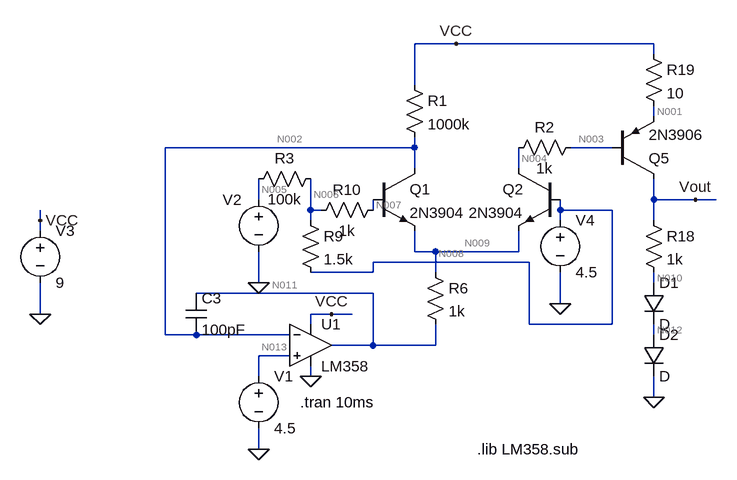
[diagram p0: schematic ExponentialSource_BJT.asc]
ExponentialSource_BJT.asc, the LTspice schematic file:
Version 4
SHEET 1 1524 724
WIRE 32 48 -32 48
WIRE 336 48 32 48
WIRE 336 64 336 48
WIRE -32 112 -32 48
WIRE 336 160 336 144
WIRE -32 208 -32 192
WIRE -32 208 -416 208
WIRE 272 208 208 208
WIRE -32 240 -32 208
WIRE 128 240 128 208
WIRE -272 288 -272 256
WIRE 336 288 336 256
WIRE 400 288 336 288
WIRE 432 288 400 288
WIRE -192 304 -192 256
WIRE -176 304 -192 304
WIRE -96 304 -96 288
WIRE 192 304 192 288
WIRE 272 304 192 304
WIRE -608 320 -608 304
WIRE -192 320 -192 304
WIRE 192 320 192 304
WIRE 336 320 336 288
WIRE -608 336 -608 320
WIRE -32 368 -32 336
WIRE 0 368 -32 368
WIRE 128 368 128 336
WIRE 128 368 0 368
WIRE 144 384 -96 384
WIRE -96 400 -96 384
WIRE -96 400 -192 400
WIRE 0 400 0 368
WIRE -272 416 -272 368
WIRE 336 416 336 400
WIRE -96 432 -368 432
WIRE 192 448 192 400
WIRE -608 464 -608 416
WIRE -160 464 -192 464
WIRE -128 464 -160 464
WIRE -192 480 -192 464
WIRE 144 480 144 384
WIRE 272 480 272 304
WIRE 272 480 144 480
WIRE -416 496 -416 208
WIRE -368 496 -416 496
WIRE -224 496 -368 496
WIRE 336 496 336 480
WIRE -96 512 -96 432
WIRE -96 512 -160 512
WIRE 0 512 0 480
WIRE 0 512 -96 512
WIRE -224 528 -272 528
WIRE -272 560 -272 528
WIRE -192 560 -192 544
WIRE 336 592 336 560
WIRE -272 672 -272 640
FLAG -272 416 0
FLAG -192 560 0
FLAG -608 320 VCC
FLAG -608 464 0
FLAG 32 48 VCC
FLAG -160 464 VCC
FLAG -272 672 0
FLAG 192 448 0
FLAG 336 592 0
FLAG 400 288 Vout
SYMBOL npn -96 240 R0
SYMATTR InstName Q1
SYMATTR Value 2N3904
SYMBOL npn 192 240 M0
SYMATTR InstName Q2
SYMATTR Value 2N3904
SYMBOL voltage -272 272 R0
WINDOW 123 0 0 Left 2
WINDOW 39 0 0 Left 2
WINDOW 0 -55 16 Left 2
WINDOW 3 24 96 Invisible 2
SYMATTR InstName V2
SYMATTR Value PWL(0 8 10ms 1)
SYMBOL res -48 96 R0
SYMATTR InstName R1
SYMATTR Value 1000k
SYMBOL Opamps\\opamp2 -192 448 R0
SYMATTR InstName U1
SYMATTR Value LM358
SYMBOL res -16 384 R0
SYMATTR InstName R6
SYMATTR Value 1k
SYMBOL voltage -608 320 R0
WINDOW 123 0 0 Left 2
WINDOW 39 0 0 Left 2
SYMATTR InstName V3
SYMATTR Value 9
SYMBOL res -176 240 R90
WINDOW 0 0 56 VBottom 2
WINDOW 3 32 56 VTop 2
SYMATTR InstName R3
SYMATTR Value 100k
SYMBOL res -208 304 R0
SYMATTR InstName R9
SYMATTR Value 1.5k
SYMBOL res -80 288 R90
WINDOW 0 0 56 VBottom 2
WINDOW 3 32 56 VTop 2
SYMATTR InstName R10
SYMATTR Value 1k
SYMBOL pnp 272 256 M180
SYMATTR InstName Q5
SYMATTR Value 2N3906
SYMBOL res 320 304 R0
SYMATTR InstName R18
SYMATTR Value 1k
SYMBOL res 320 48 R0
SYMATTR InstName R19
SYMATTR Value 10
SYMBOL res 224 192 R90
WINDOW 0 0 56 VBottom 2
WINDOW 3 32 56 VTop 2
SYMATTR InstName R2
SYMATTR Value 1k
SYMBOL cap -384 432 R0
SYMATTR InstName C3
SYMATTR Value 100pF
SYMBOL voltage -272 544 R0
WINDOW 123 0 0 Left 2
WINDOW 39 0 0 Left 2
SYMATTR InstName V1
SYMATTR Value 4.5
SYMBOL voltage 192 304 R0
WINDOW 123 0 0 Left 2
WINDOW 39 0 0 Left 2
SYMATTR InstName V4
SYMATTR Value 4.5
SYMBOL diode 320 416 R0
SYMATTR InstName D1
SYMBOL diode 320 496 R0
SYMATTR InstName D2
TEXT -208 600 Left 2 !.tran 10ms
TEXT 64 672 Left 2 !.lib LM358.sub

The netlist it stands for:
* ExponentialSource_BJT.asc
Q1 N002 N007 N009 0 2N3904
Q2 N004 N008 N009 0 2N3904
V2 N005 0 PWL(0 8 10ms 1)
R1 VCC N002 1000k
XU1 N013 N002 VCC 0 N011 LM358  ; pins In+ In- V+ V- OUT
R6 N009 N011 1k
V3 VCC 0 9
R3 N006 N005 100k
R9 N006 N008 1.5k
R10 N007 N006 1k
Q5 Vout N003 N001 0 2N3906
R18 Vout N010 1k
R19 VCC N001 10
R2 N003 N004 1k
C3 N011 N002 100pF
V1 N013 0 4.5
V4 N008 0 4.5
D1 N010 N012 D
D2 N012 0 D
.model D D
.lib standard.dio
.model NPN NPN
.model PNP PNP
.lib standard.bjt
.tran 10ms
.lib LM358.sub
.backanno
.end

* Results of the author's LTspice run, read from the files saved beside the schematic
* Operating Point, zero values left out:
*   V(n002) = 4.5 V
*   V(n007) = 4.552 V
*   V(n009) = 4.036 V
*   V(n004) = 8.396 V
*   V(n008) = 4.5 V
*   V(n005) = 8 V
*   V(vcc) = 9 V
*   V(n011) = 4.031 V
*   V(n013) = 4.5 V
*   V(n006) = 4.552 V
*   V(vout) = 1.343 V
*   V(n003) = 8.397 V
*   V(n001) = 8.999 V
*   V(n010) = 1.207 V
*   V(n012) = 603.6 mV
*   Ic(Q5) = -136.3 µA
*   Ib(Q5) = -637 nA
*   Ie(Q5) = 137 µA
*   Ic(Q2) = 637 nA
*   Ib(Q2) = 2.04 nA
*   Ie(Q2) = -639 nA
*   Ic(Q1) = 4.52 µA
*   Ib(Q1) = 15.08 nA
*   Ie(Q1) = -4.535 µA
*   I(D2) = 136.3 µA
*   I(D1) = 136.3 µA
*   I(R2) = 637 nA
*   I(R19) = 137 µA
*   I(R18) = 136.3 µA
*   I(R10) = -15.08 nA
*   I(R9) = 34.47 µA
*   I(R3) = -34.48 µA
*   I(R6) = 5.174 µA
*   I(R1) = 4.5 µA
*   I(V4) = 34.47 µA
*   I(V1) = 19.93 nA
*   I(V3) = -448.4 µA
*   I(V2) = -34.48 µA
*   Ix(u1:1) = -19.93 nA
*   Ix(u1:2) = -19.94 nA
*   Ix(u1:3) = 307 µA
*   Ix(u1:4) = -306.9 µA
*   Ix(u1:5) = 5.174 µA
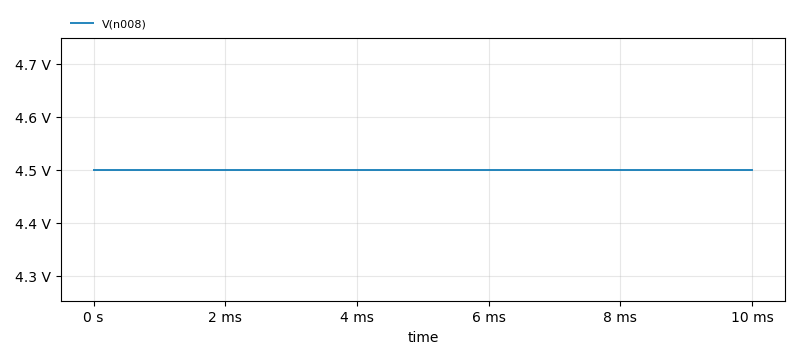
[diagram p1: Transient Analysis of ExponentialSource_BJT.asc, plotted from the saved traces]
* Transient Analysis, 1 run:
*   V(n008): min 4.5 V, max 4.5 V, average 4.5 V, rms 4.5 V, last 4.5 V